# EAGLE design button (EAGLE 9.4.2)
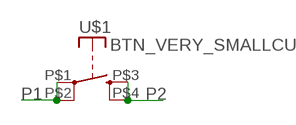
[diagram p0: schematic, sheet 1]

## Parts
U$1  BTN_VERY_SMALLCUT  [BTN-VS-CUT]

## Nets
P1: U$1.P$1(P) U$1.P$2(P)
P2: U$1.P$3(S) U$1.P$4(S)

## Library data of the parts
U$1 = NEON-BLADE-2023:BTN_VERY_SMALL

## Board
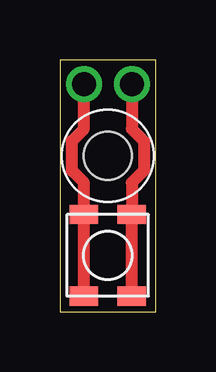
[diagram p1: board, top side]

Size 4 x 10.5 mm. Coordinates in mm from the lower left corner, seen from the top.
Outline: 0,0 4,0 4,10.5 0,10.5 0,0
Copper layers (1*16): Top 0.035mm / dielectric 1.5mm / Bottom 0.035mm
Design rules "default *": minimum track width 0.00508125mm, minimum drill 0.35mm, track to track 0.2mm, track to pad 0.2mm, pad to pad 0.2mm, via to via 0.2mm, smd to smd 0.2mm, copper to edge 0.25mm, drill to drill 6mil, minimum pad ring 10mil, minimum via ring 8mil, stop-mask expansion 4mil, vias tented up to drill 0mil, thermal gap 10mil
Holes 2 mm at 2,6.5

### Footprints (pad centres in the part's own frame; a part is rotated, then mirrored left to right if it is on the bottom)
BTN-VS-CUT = smd 0.8 x 1.2: P$1 -1.7,1; P$2 1.7,1; P$3 1.7,-1; P$4 -1.7,-1

### Placement (x,y rotation side)
U$1  2,2.35 90 top

### Tracks (layer width: path | path; a pad name or v marks a point on that pad's centre or on a via)
P1  (via drill 1)
  Top 0.5: v1,9.5 1,7.62 0.5,7.12 0.5,5.88 1,5.38 U$1.P$2 U$1.P$1
P2  (via drill 1)
  Top 0.5: v3,9.5 3,7.62 3.5,7.12 3.5,5.88 3,5.38 U$1.P$3 U$1.P$4